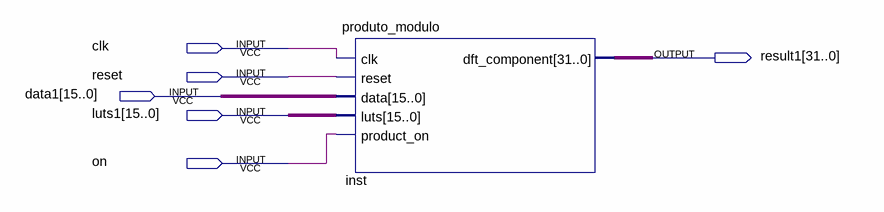
[diagram p0: schematic sheet]
// Quartus schematic execucao_produto.bdf as structural Verilog: 1 symbols, 6 pins
module execucao_produto (
  input  clk,
  input  reset,
  input  [15:0] data1,
  input  [15:0] luts1,
  input  on,
  output [31:0] result1
);

  produto_modulo inst (.clk(clk), .reset(reset), .data(data1), .luts(luts1), .product_on(on), .dft_component(result1));
endmodule
